# Altium schematic sheet Glucometer-I.C.- Full V2.SchDoc
size A4; PageSetup: Record=PageOptions|CenterHorizontal=True|CenterVertical=True|PrintScale=0.91|XCorrection=1.00|YCorrection=1.00|PrintKind=1|BorderSize=5000000|LeftOffset=0|BottomOffset=0|Orientation=2|PaperLength=1000|PaperWidth=1000|Scale=100|PaperSource=7|PrintQuality=-4|MediaType=1|DitherType=10|PaperKind=Carta|PrintScaleMode=1
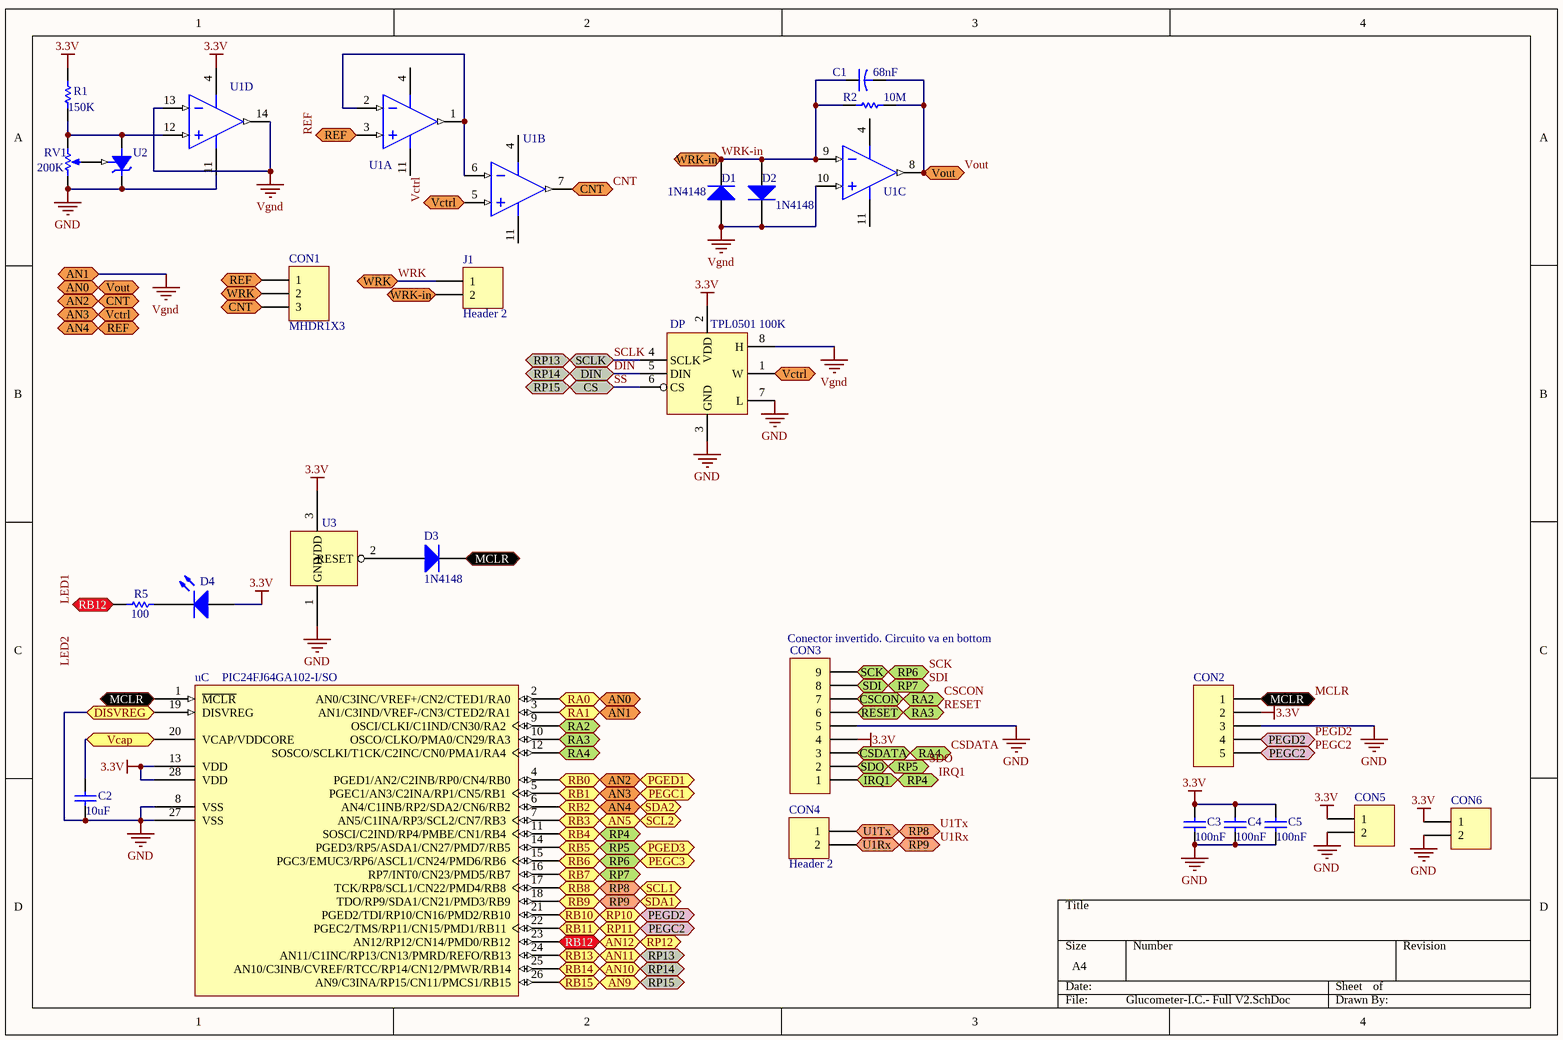
[diagram p0: Glucometer-I.C.- Full V2.SchDoc]

## Parts
C1  value 68nF  [CAPC1608N]  (hidden comment: Cap2)
C2  value 10uF  [CAPC2012N]  (hidden comment: Cap)
C3  value 100nF  [CAPC1608N]  (hidden comment: Cap)
C4  value 100nF  [CAPC1608N]  (hidden comment: Cap)
C5  value 100nF  [CAPC1608N]  (hidden comment: Cap)
CON1  MHDR1X3  [MHDR1X3]
CON2  Header 5  [HDR1X5]  (value not drawn)
CON3  Header 9  [HDR1X9]  (value not drawn)
CON4  Header 2  [HDR1X2]
CON5  Header 2  [HDR1X2]  (value not drawn)
CON6  Header 2  [HDR1X2]  (value not drawn)
D1  1N4148  [CD3216-1206]
D2  1N4148  [CD3216-1206]
D3  1N4148  [CD3216-1206]
D4  LED2  [3.2X1.6X1.1]  (value not drawn)
DP  TPL0501 100K  [8SOT-23]
J1  Header 2  [HDR1X2]
R1  value 150K  [RESC2012N]  (hidden comment: Res1)
R2  value 10M  [RESC2012N]  (hidden comment: Res1)
R5  value 100  [RESC2012N]  (hidden comment: Res1)
RV1  value 200K  [SOT23-3N]  (hidden comment: RPot)
U1  LMC6044IN  [M14A_N]  (value not drawn)  (parts A,B,C,D of 4)
U2  LM4041CEM3-ADJ/NOPB  [MF03A_N]  (value not drawn)
U3  Supply Voltage Supervisor  [SOT23]  (value not drawn)
uC  PIC24FJ64GA102-I/SO  [SOIC-SO28_N]

## Ports
AN0, AN1, AN2, AN3, AN4, AN5, AN9, AN10, AN11, AN12, CNT, CS, CSCON, CSDATA, DIN, DISVREG, IRQ1, MCLR, PEGC1, PEGC2, PEGC3, PEGD2, PGED1, PGED3, RA0, RA1, RA2, RA3, RA4, RB0, RB1, RB2, RB3, RB4, RB5, RB6, RB7, RB8, RB9, RB10, RB11, RB12, RB13, RB14, RB15, REF, RESET, RP4, RP5, RP6, RP7, RP8, RP9, RP10, RP11, RP12, RP13, RP14, RP15, SCK, SCL1, SCL2, SCLK, SDA1, SDA2, SDI, SDO, U1Rx, U1Tx, Vcap, Vctrl, Vout, WRK, WRK-in

## Nets
3.3V: C3.2 C4.2 C5.2 CON2.2 CON3.4 CON5.1 CON6.1 D4.1(A) DP.2(VDD) R1.2 U1.4(V+) U3.3(VDD) uC.13(VDD) uC.28(VDD)
GND: C2.1 C3.1 C4.1 C5.1 CON2.3 CON3.5 CON5.2 CON6.2 DP.3(GND) DP.7(L) RV1.1(TOP) U1.11(V-) U2.2(+V) U3.1(GND) uC.8(VSS) uC.19(DISVREG) uC.27(VSS) ; port DISVREG
Vgnd: D1.1(A) D2.2(K) DP.8(H) U1.10(IN3+) U1.13(IN4-) U1.14(OUT4) uC.3(AN1/C3IND/VREF-/CN3/CTED2/RA1) ; port RA1, port AN1
AN5: uC.7(AN5/C1INA/RP3/SCL2/CN7/RB3) ; port RB3, port SCL2, port AN5
CNT: CON1.3 U1.7(OUT2) uC.4(PGED1/AN2/C2INB/RP0/CN4/RB0) ; port CNT, port RB0, port AN2, port PGED1
CSCON: CON3.7 uC.9(OSCI/CLKI/C1IND/CN30/RA2) ; port CSCON, port RA2
CSDATA: CON3.3 uC.12(SOSCO/SCLKI/T1CK/C2INC/CN0/PMA1/RA4) ; port RA4, port CSDATA
DIN: DP.5(DIN) uC.25(AN10/C3INB/CVREF/RTCC/RP14/CN12/PMWR/RB14) ; port AN10, port DIN, port RB14, port RP14
IRQ1: CON3.1 uC.11(SOSCI/C2IND/RP4/PMBE/CN1/RB4) ; port RB4, port RP4, port IRQ1
LED1: R5.1 uC.23(AN12/RP12/CN14/PMD0/RB12) ; port RB12, port AN12, port RP12
MCLR: CON2.1 D3.2(K) uC.1(~{MCLR}) ; port MCLR
PEGC2: CON2.5 uC.22(PGEC2/TMS/RP11/CN15/PMD1/RB11) ; port RB11, port RP11, port PEGC2
PEGD2: CON2.4 uC.21(PGED2/TDI/RP10/CN16/PMD2/RB10) ; port RB10, port RP10, port PEGD2
REF: CON1.1 U1.3(IN1+) uC.6(AN4/C1INB/RP2/SDA2/CN6/RB2) ; port REF, port RB2, port AN4, port SDA2
RESET: CON3.6 uC.10(OSCO/CLKO/PMA0/CN29/RA3) ; port RA3, port RESET
SCK: CON3.9 uC.15(PGC3/EMUC3/RP6/ASCL1/CN24/PMD6/RB6) ; port RP6, port PEGC3, port SCK, port RB6
SCLK: DP.4(SCLK) uC.24(AN11/C1INC/RP13/CN13/PMRD/REFO/RB13) ; port RB13, port AN11, port SCLK, port RP13
SDI: CON3.8 uC.16(RP7/INT0/CN23/PMD5/RB7) ; port RP7, port SDI, port RB7
SDO: CON3.2 uC.14(PGED3/RP5/ASDA1/CN27/PMD7/RB5) ; port RP5, port PGED3, port SDO, port RB5
SS: DP.6(CS) uC.26(AN9/C3INA/RP15/CN11/PMCS1/RB15) ; port AN9, port CS, port RB15, port RP15
U1Rx: CON4.2 uC.18(TDO/RP9/SDA1/CN21/PMD3/RB9) ; port RB9, port RP9, port U1Rx, port SDA1
U1Tx: CON4.1 uC.17(TCK/RP8/SCL1/CN22/PMD4/RB8) ; port RB8, port RP8, port U1Tx, port SCL1
Vcap: C2.2 uC.20(VCAP/VDDCORE) ; port Vcap
Vctrl: DP.1(W) U1.5(IN2+) uC.5(PGEC1/AN3/C2INA/RP1/CN5/RB1) ; port Vctrl, port RB1, port AN3, port PEGC1
Vout: C1.2 R2.1 U1.8(OUT3) uC.2(AN0/C3INC/VREF+/CN2/CTED1/RA0) ; port Vout, port AN0, port RA0
WRK: CON1.2 J1.1 ; port WRK
WRK-in: C1.1 D1.2(K) D2.1(A) J1.2 R2.2 U1.9(IN3-) ; port WRK-in
NetD3_1: D3.1(A) U3.2(RESET)
NetD4_2: D4.2(K) R5.2
NetR1_1: R1.1 RV1.2(BOT) U1.12(IN4+) U2.3(-V)
NetRV1_3: RV1.3(TAP) U2.1(FB)
NetU1_1: U1.1(OUT1) U1.2(IN1-) U1.6(IN2-)

## Notes on the sheet
- (near CON3) Conector invertido. Circuito va en bottom
- Labels drawn without touching a wire or pin: LED2

## Library data of the parts
C1 = Cap2: Capacitor; Published: 23-Sep-2002; PackageReference: CAPR5-4X5; Publisher: Altium Limited; PackageDescription: Capacitor; 2 Leads
C2-C5 = Cap: Capacitor; Published: 8-Jun-2000; LatestRevisionDate: 17-Jul-2002; LatestRevisionNote: Re-released for DXP Platform.; PackageReference: RAD-0.3; Publisher: Altium Limited; PackageDescription: Radial Cap, Thru-Hole; 2 Leads; 0.3 in Pin Spacing
CON1 = MHDR1X3: Header, 3-Pin; LatestRevisionDate: 17-Jul-2002; LatestRevisionNote: Re-released for DXP Platform.; Publisher: Altium Limited
CON2 = Header 5: Header, 5-Pin; LatestRevisionDate: 17-Jul-2002; LatestRevisionNote: Re-released for DXP Platform.; Publisher: Altium Limited
CON3 = Header 9: Header, 9-Pin; LatestRevisionDate: 17-Jul-2002; LatestRevisionNote: Re-released for DXP Platform.; Publisher: Altium Limited
CON4-CON6 J1 = Header 2: Header, 2-Pin; LatestRevisionDate: 17-Jul-2002; LatestRevisionNote: Re-released for DXP Platform.; Publisher: Altium Limited
D1-D3 = 1N4148: High Conductance Fast Diode; Published: 8-Jun-2000; LatestRevisionDate: 17-Jul-2002; LatestRevisionNote: Re-released for DXP Platform.; DatasheetDocument: 1997; PackageReference: DO-35; Publisher: Altium Limited; Code_JEDEC: DO-204-AH; ComponentLink1Description: Manufacturer Link; ComponentLink1URL: http://www.fairchildsemi.com/; ComponentLink2Description: Datasheet; ComponentLink2URL: http://www.fairchildsemi.com/ds/1N%2F1N4148.pdf
D4 = LED2: Typical RED, GREEN, YELLOW, AMBER GaAs LED; Published: 8-Jun-2000; LatestRevisionDate: 17-Jul-2002; LatestRevisionNote: Re-released for DXP Platform.; PackageVersion: Feb-2002; PackageReference: 3.2X1.6X1.1; Publisher: Altium Limited; PackageDescription: SM LED; 2 Flat Leads
DP = Digital Potentiometer TI
R1 R2 R5 = Res1: Resistor; Published: 8-Jun-2000; LatestRevisionDate: 17-Jul-2002; LatestRevisionNote: Re-released for DXP Platform.; PackageReference: AXIAL-0.3; Publisher: Altium Limited; PackageDescription: Axial Device, Thru-Hole; 2 Leads; 0.3 in Pin Spacing
RV1 = RPot: Potentiometer; pin to pad: 2>3 3>2; Sim Note: Enter the Resistance value and the set point into parameter fields.; Set Position: 0.5; Published: 8-Jun-2000; LatestRevisionDate: 17-Jul-2002; LatestRevisionNote: Re-released for DXP Platform.; PackageReference: VR5; Publisher: Altium Limited; PackageDescription: Variable Resistor, Thru-Hole; 3 Leads
U1 = LMC6044IN: CMOS Quad Micropower Operational Amplifier, 14-pin MDIP; Manufacturer: National Semiconductor; PackageTopMarking: NSUZXYYTTE#*LMC6044IN; PowerWise: Y; CompType: Amplifiers; Published: 4-Dec-2008; LatestRevisionDate: 13-Jan-2009; LatestRevisionNote: Sim Model Added.; DatasheetVersion: Aug-2000; PackageVersion: revG, May-2006; PackageReference: N14A; Publisher: Altium Limited; PackageDescription: MDIP, .750 x .250 x.130in, 14 Lead, .100in Pitch; Supplier 1: Farnell; Supplier Part Number 1: 9494634; PartNumber: LMC6044IN; RoHS: N; PinCount: 14; Code_JEDEC: MS-001-AA; ComponentLink1Description: LMC6044 Datasheet; ComponentLink1URL: http://www.national.com/ds/LM/LMC6044.pdf; ComponentLink2Description: LMC6044 Web Page; ComponentLink2URL: http://www.national.com/pf/LM/LMC6044.html; ComponentLink3Description: N14A Package Page; ComponentLink3URL: http://www.national.com/packaging/folders/n14a.html
U2 = LM4041CEM3-ADJ/NOPB: Precision Micropower Shunt Voltage Reference, 3-pin SOT-23, Pb-Free; Manufacturer: National Semiconductor; PackageTopMarking: RAC*XTT; PowerWise: N; CompType: Voltage Reference IC; Published: 1-Mar-2010; DatasheetVersion: Mar-2005; PackageVersion: revB, Mar-2003; PackageReference: MF03A; Publisher: Altium Limited; PackageDescription: Molded SOT-23, .115 x .051 x .037in Body, 3 Lead, .075 in Pitch; Supplier 1: Digi-Key; Supplier Part Number 1: LM4041CEM3-ADJTR-ND; Supplier 2: Digi-Key; Supplier Part Number 2: LM4041CEM3-ADJCT-ND; Supplier 3: Digi-Key; Supplier Part Number 3: LM4041CEM3-ADJDKR-ND; Supplier 4: Farnell; Supplier Part Number 4: 1673994; PartNumber: LM4041CEM3-ADJ/NOPB; RoHS: Y; PinCount: 3; ComponentLink1Description: LM4041 Datasheet; ComponentLink1URL: http://www.national.com/ds/LM/LM4041.pdf; ComponentLink2Description: LM4041 Web Page; ComponentLink2URL: http://www.national.com/pf/LM/LM4041.html; ComponentLink3Description: MF03A Package Page; ComponentLink3URL: http://www.national.com/packaging/folders/mf03a.html
uC = PIC24FJ64GA102-I/SO: General purpose 16-bit Flash Microcontroller with nanoWatt XLP, 64KB Flash, 8KB SRAM, 28-Pin SOIC, Industrial Temperature; Published: 2-Dec-2009; LatestRevisionDate: 07-Oct-2010; LatestRevisionNote: Updated to datasheet revision C, Aug-2010. Supplier links updated. Sch. pin 7 name corrected.; DatasheetVersion: revC, Aug-2010; PackageVersion: revBB, Aug-2009; PackageReference: SOIC-SO28; Publisher: Altium Limited; PackageDescription: 28-Lead Plastic Small Outline (SO) - Wide 7.50mm Body [SOIC]; Supplier 1: Digi-Key; Supplier Part Number 1: PIC24FJ64GA102-I/SO-ND; Supplier 2: Farnell; Supplier Part Number 2: 1778478; Code_JEDEC: MS-013; ComponentLink1Description: Datasheet; ComponentLink1URL: http://ww1.microchip.com/downloads/en/DeviceDoc/39951C.pdf; ComponentLink2Description: Packaging Specification; ComponentLink2URL: http://www.microchip.com/stellent/groups/techpub_sg/documents/packagingspec/en012702.pdf; ComponentLink3Description: Microchip.com Home; ComponentLink3URL: http://www.microchip.com/